# Altium project dreamViewRelease.PrjPcb
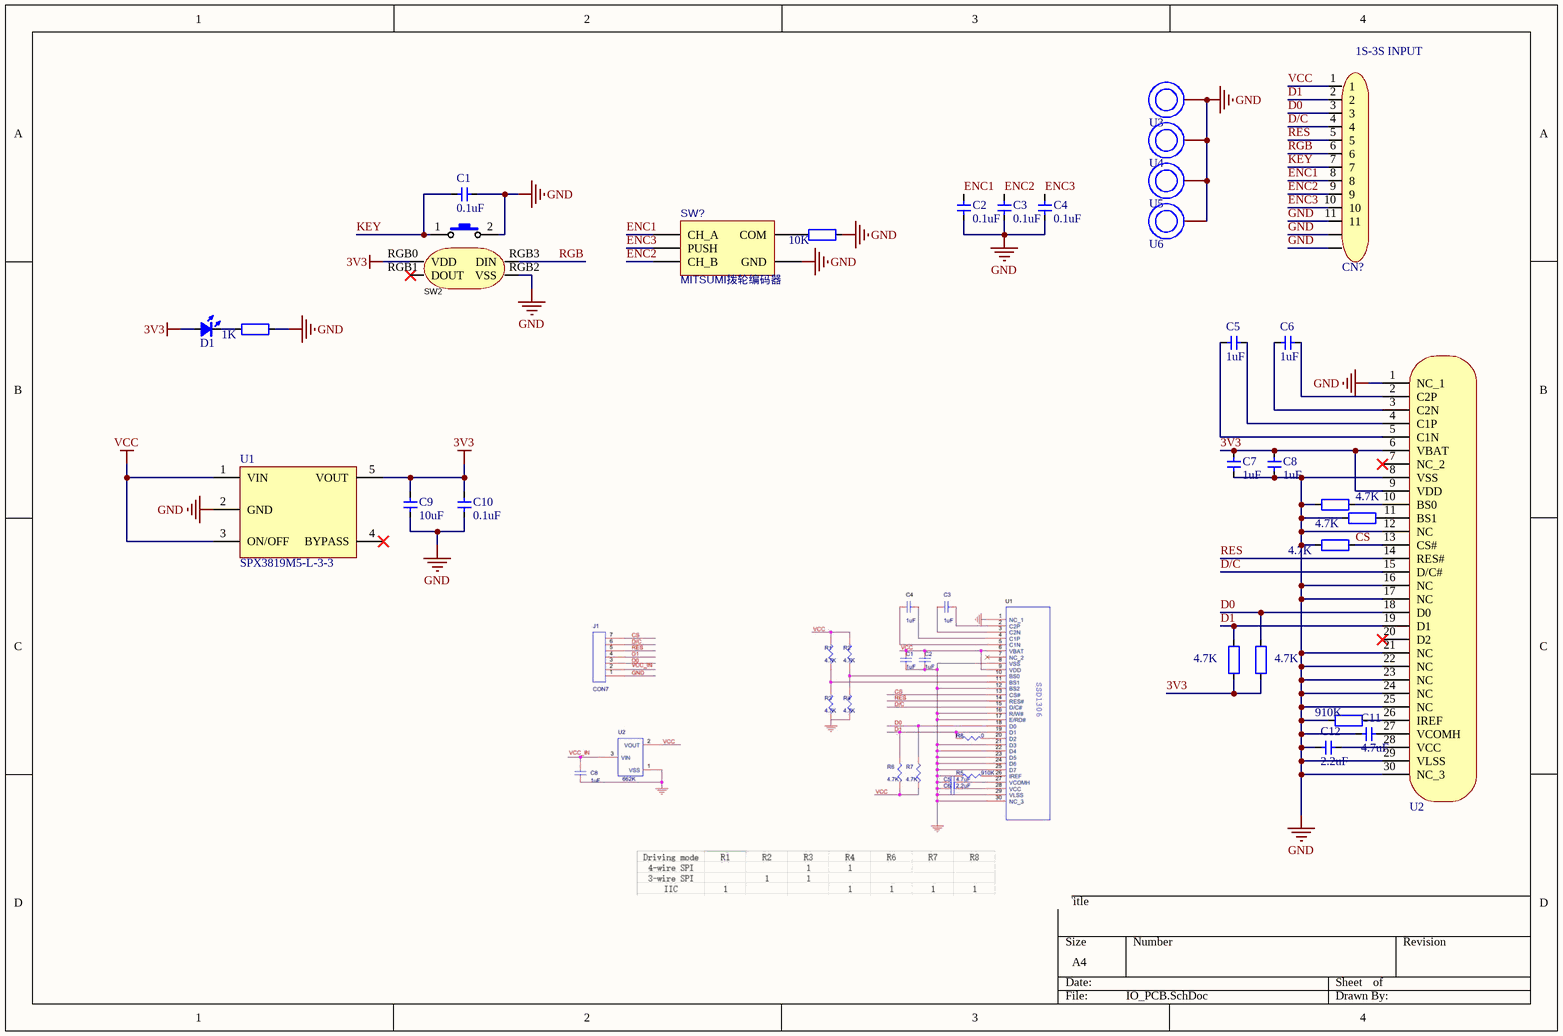
[diagram p0: IO_PCB.SchDoc]
1 sheet, 30 parts. Net scope: global (net labels, ports and power ports of the same name join across sheets).
Board file: IO_PCB.PcbDoc

## Sheet IO_PCB.SchDoc
size A4

### Parts
C1  0.1uF  [CAP_0402]
C2  0.1uF  [CAP_0402]
C3  0.1uF  [CAP_0402]
C4  0.1uF  [CAP_0402]
C5  1uF  [CAP_0402]
C6  1uF  [CAP_0402]
C7  1uF  [CAP_0402]
C8  1uF  [CAP_0402]
C9  10uF  [CAP_1206]
C10  0.1uF  [CAP_1206]
C11  4.7uF  [CAP_0402]
C12  2.2uF  [CAP_0402]
CN?  X1002WRS-11B1-9TSN  [FPC-SMD_P0.50-11P_LCS-SJ-H2.0]  (value not drawn)
D1  color?  [LED_0402]  (value not drawn)
R5  4.7K  [RES_0402]
R6  4.7K  [RES_0402]
R7  4.7K  [RES_0402]
R8  4.7K  [RES_0402]
R9  4.7K  [RES_0402]
R10  910K  [RES_0402]
R21  1K  [RES_0402]
R?  10K  [RES_0402]
SW2  佳达隆带灯热插拔矮轴  [Gateron_Switch_Direct]  (value not drawn)
SW?  MITSUMI拨轮编码器  [SIQ_02FVS3]
U1  SPX3819M5-L-3-3  [SOT23_5]
U2  SSD1306/15  [OLED_0.96_30P]  (value not drawn)
U3  螺柱孔  [M1]  (value not drawn)
U4  螺柱孔  [M1]  (value not drawn)
U5  螺柱孔  [M1]  (value not drawn)
U6  螺柱孔  [M1]  (value not drawn)

### Nets
3V3: C7.1 C8.1 C9.2 C10.2 D1.1(A) R8.2 R9.2 SW2.RGB0(VDD) U1.5(VOUT) U2.6(VBAT) U2.9(VDD)
GND: C1.2 C2.1 C3.1 C4.1 C7.2 C8.2 C9.1 C10.1 C11.1 C12.1 CN?.11 CN?.12 CN?.13 R5.1 R6.1 R7.1 R10.2 R21.2 R?.2 SW2.2 SW2.RGB2(VSS) SW?.5(GND) U1.2(GND) U2.1(NC_1) U2.8(VSS) U2.12(NC) U2.16(NC) U2.17(NC) U2.21(NC) U2.22(NC) U2.23(NC) U2.24(NC) U2.25(NC) U2.29(VLSS) U2.30(NC_3) U3.1 U4.1 U5.1 U6.1
VCC: CN?.1 U1.1(VIN) U1.3(ON/OFF)
CS: R7.2 U2.13(CS#)
D0: CN?.3 R9.1 U2.18(D0)
D1: CN?.2 R8.1 U2.19(D1)
D/C: CN?.4 U2.15(D/C#)
ENC1: C2.2 CN?.8 SW?.1(CH_A)
ENC2: C3.2 CN?.9 SW?.4(CH_B)
ENC3: C4.2 CN?.10 SW?.2(PUSH)
KEY: C1.1 CN?.7 SW2.1
RES: CN?.5 U2.14(RES#)
RGB: CN?.6 SW2.RGB3(DIN)
NetC5_1: C5.1 U2.4(C1P)
NetC5_2: C5.2 U2.5(C1N)
NetC6_1: C6.1 U2.2(C2P)
NetC6_2: C6.2 U2.3(C2N)
NetC11_2: C11.2 U2.27(VCOMH)
NetC12_2: C12.2 U2.28(VCC)
NetD1_2: D1.2(K) R21.1
NetR5_2: R5.2 U2.10(BS0)
NetR6_2: R6.2 U2.11(BS1)
NetR10_1: R10.1 U2.26(IREF)
NetR?_1: R?.1 SW?.3(COM)

Not connected (* = marked no-connect by the designer): SW2 RGB1(DOUT)*; U1 4(BYPASS)*; U2 7(NC_2)* 20(D2)*

### Notes on the sheet
- (near CN?) 1S-3S INPUT

### Library data of the parts
C1-C12 = Capacitor_MLCC
CN? = 11P端子: Manufacturer: XKB Connectivity(中国星坤); Add into BOM: yes; Pitch: 1mm; Pins Structure: 1x11P; Number of PINs Per Row: 11; Gender: 公型插针; Current Rating (Max): 1A; Welding Temperature (Max): 260℃; Name: X1002WRS-11B1-9TSN; Symbol: X1002WRS-11B1-9TSN; Device: X1002WRS-11B1-9TSN; LCSC Part Name: 1mm 1x11P 卧贴 带锁扣; Supplier Part: C528067; Manufacturer Part: X1002WRS-11B1-9TSN; Supplier Footprint: SMD,P=1mm; JLCPCB Part Class: 扩展库; Datasheet: https://atta.szlcsc.com/upload/public/pdf/source/20211011/1437E7AC5BA28D97E3BC6E2D0E99510D.pdf; Supplier: LCSC; Convert to PCB: yes; Reference Series: -; Number of Rows: 1; Row Spacing: -; Mounting Style: 卧贴; Contact Material: 黄铜; Contact Plating: 锡; Operating Temperature Range: -25℃~+85℃
D1 = LED: Value: color?
R5-R10 R21 R? = Resistor_SMD: Value: 22R
SW2 = Gateron_Switch_Low: Add into BOM: yes; Symbol: 带灯热插拔矮轴; Device: 带灯热插拔矮轴; Convert to PCB: yes
SW? = MITSUMI_Encoder: MITSUMI美上美拨轮编码器; BOM_Manufacturer: ALPSALPINE; BOM_Manufacturer Part: EC11E1534443; Contributor: LCSC; BOM_Supplier: LCSC; BOM_Supplier Part: C1322543; BOM_JLCPCB Part Class: Extended Part; spicePre: S; spiceSymbolName: EC11E1534443
U1 = LP2992: LP2992_LDO
U2 = SSD1306-12864: Convert to PCB: yes; Symbol: SSD1306/15; Device: SSD1306/15; Add into BOM: yes
U3-U6 = Hole: Symbol: M2螺柱孔; Add into BOM: yes; _: 3; Device: M2螺柱孔; Convert to PCB: yes